# EAGLE design Homebrew Companion Board v2 (EAGLE 9.6.2)
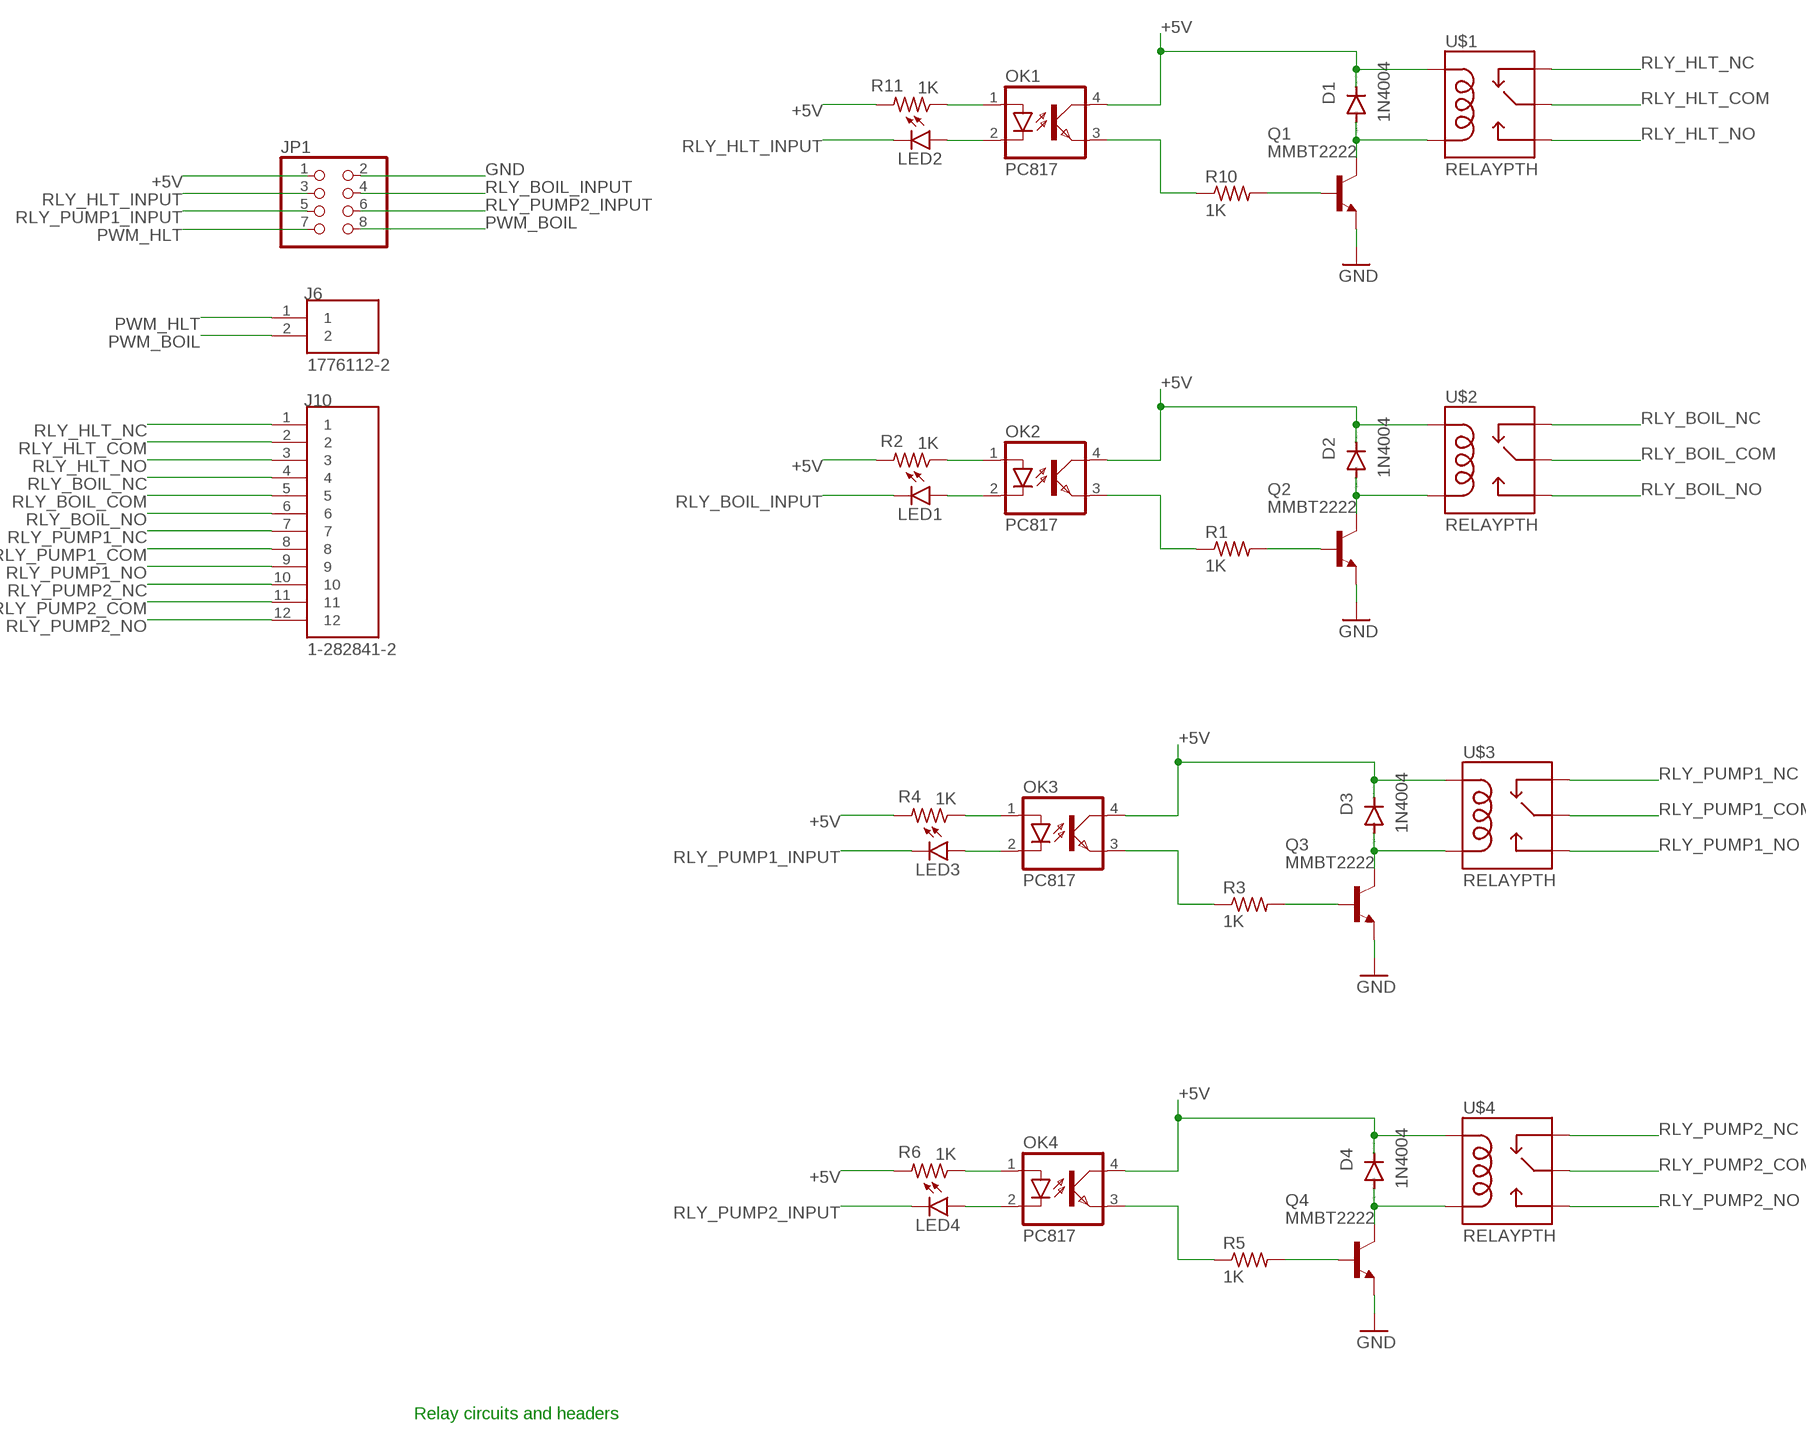
[diagram p0: schematic, sheet 1]

## Parts
D1  1N4004  [DO41-10]
D2  1N4004  [DO41-10]
D3  1N4004  [DO41-10]
D4  1N4004  [DO41-10]
J6  1776112-2  [TE_1776112-2]
J10  1-282841-2  [TE_1-282841-2]
JP1  PINHD-2X4  [2X04]
LED1  LEDCHIP-LED0805  [CHIP-LED0805]
LED2  LEDCHIP-LED0805  [CHIP-LED0805]
LED3  LEDCHIP-LED0805  [CHIP-LED0805]
LED4  LEDCHIP-LED0805  [CHIP-LED0805]
OK1  PC817  [DIL04]
OK2  PC817  [DIL04]
OK3  PC817  [DIL04]
OK4  PC817  [DIL04]
Q1  MMBT2222  [SOT23-BEC]
Q2  MMBT2222  [SOT23-BEC]
Q3  MMBT2222  [SOT23-BEC]
Q4  MMBT2222  [SOT23-BEC]
R1  1K  R-US_R0603  [R0603]
R2  1K  R-US_R0603  [R0603]
R3  1K  R-US_R0603  [R0603]
R4  1K  R-US_R0603  [R0603]
R5  1K  R-US_R0603  [R0603]
R6  1K  R-US_R0603  [R0603]
R10  1K  R-US_R0603  [R0603]
R11  1K  R-US_R0603  [R0603]
U$1  RELAYPTH  [SRD-05VDC-SL-C]
U$2  RELAYPTH  [SRD-05VDC-SL-C]
U$3  RELAYPTH  [SRD-05VDC-SL-C]
U$4  RELAYPTH  [SRD-05VDC-SL-C]

## Nets
+5V: D1.C D2.C D3.C D4.C JP1.1 OK1.4(COL) OK2.4(COL) OK3.4(COL) OK4.4(COL) R2.2 R4.2 R6.2 R11.2 U$1.COIL1 U$2.COIL1 U$3.COIL1 U$4.COIL1
GND: JP1.2 Q1.E Q2.E Q3.E Q4.E
N$1: D2.A Q2.C U$2.COIL0
N$2: D1.A Q1.C U$1.COIL0
N$3: LED2.A OK1.2(C)
N$4: Q1.B R10.2
N$5: OK1.3(EMIT) R10.1
N$6: OK1.1(A) R11.1
N$7: LED1.A OK2.2(C)
N$8: Q2.B R1.2
N$9: OK2.3(EMIT) R1.1
N$10: OK2.1(A) R2.1
N$11: D3.A Q3.C U$3.COIL0
N$12: LED3.A OK3.2(C)
N$13: Q3.B R3.2
N$14: OK3.3(EMIT) R3.1
N$15: OK3.1(A) R4.1
N$16: D4.A Q4.C U$4.COIL0
N$17: LED4.A OK4.2(C)
N$18: Q4.B R5.2
N$19: OK4.3(EMIT) R5.1
N$20: OK4.1(A) R6.1
PWM_BOIL: J6.2 JP1.8
PWM_HLT: J6.1 JP1.7
RLY_BOIL_COM: J10.5 U$2.SWCOMMON
RLY_BOIL_INPUT: JP1.4 LED1.C
RLY_BOIL_NC: J10.4 U$2.SWCLOSED(SWCLOSE)
RLY_BOIL_NO: J10.6 U$2.SWOPEN
RLY_HLT_COM: J10.2 U$1.SWCOMMON
RLY_HLT_INPUT: JP1.3 LED2.C
RLY_HLT_NC: J10.1 U$1.SWCLOSED(SWCLOSE)
RLY_HLT_NO: J10.3 U$1.SWOPEN
RLY_PUMP1_COM: J10.8 U$3.SWCOMMON
RLY_PUMP1_INPUT: JP1.5 LED3.C
RLY_PUMP1_NC: J10.7 U$3.SWCLOSED(SWCLOSE)
RLY_PUMP1_NO: J10.9 U$3.SWOPEN
RLY_PUMP2_COM: J10.11 U$4.SWCOMMON
RLY_PUMP2_INPUT: JP1.6 LED4.C
RLY_PUMP2_NC: J10.10 U$4.SWCLOSED(SWCLOSE)
RLY_PUMP2_NO: J10.12 U$4.SWOPEN

## Notes on the sheet
- Relay circuits and headers

## Library data of the parts
D1-D4 = diode:1N4004: DIODE general purpose rectifier, 1 A; MF: DIODES INC.; MPN: 1N4007-T; OC_NEWARK: 12T2304
J6 = TE-1776112-2:1776112-2: Check availability <https://pricing.snapeda.com/parts/1776112-2/TE%20Connectivity/view-part?ref=eda>; AVAILABILITY: In Stock; COMMENT: 1776112-2; DESCRIPTION: 2P,3.50MM,SIDE ENTRY,HIGH TMP; EU_ROHS_COMPLIANCE: Compliant; MF: AMP - TE CONNECTIVITY; MP: 1776112-2; MPN: 1776112-2; OC_NEWARK: 41AJ4617; PACKAGE: None; PRICE: None; PURCHASE-URL: https://pricing.snapeda.com/search/part/1776112-2/?ref=eda
J10 = TE-1-282841-2:1-282841-2: Check availability <https://pricing.snapeda.com/parts/1-282841-2/TE%20Connectivity/view-part?ref=eda>; AVAILABILITY: In Stock; COMMENT: 1-282841-2; DESCRIPTION: 12 Position Wire to Board Terminal Block Horizontal with Board 0.200 (5.08mm) Through Hole; EU_ROHS_COMPLIANCE: Compliant with Exemptions; MF: AMP - TE CONNECTIVITY; MP: 1-282841-2; MPN: 1-282841-2; OC_NEWARK: 95Y5159; PACKAGE: None; PRICE: None; PURCHASE-URL: https://pricing.snapeda.com/search/part/1-282841-2/?ref=eda
JP1 = pinhead:PINHD-2X4: PIN HEADER; MF: AMP - TE CONNECTIVITY; MPN: 826634-4; OC_NEWARK: 96Y4843
LED1-LED4 = led:LED: LED OSRAM: - CHIPLED LG R971, LG N971, LY N971, LG Q971, LY Q971, LO R971, LY R971 LH N974, LH R974 LS Q976, LO Q976, LY Q976 LO Q996 - Hyper CHIPLED LW Q18S LB Q993, LB Q99A, LB R99A - SideLED LS A670, LO A670, LY A670, LG A670, LP A670 LB A673, LV A673, LT A673, LW A673 LH A674 LY A675 LS A676, LA A676, LO A676, LY A676, LW A676 LS A679, LY A679, LG A679 - Hyper Micro SIDELED® LS Y876, LA Y876, LO Y876, LY Y876 LT Y87S - SmartLED LW L88C, LW L88S LB L89C, LB L89S, LG L890 LS L89K, LO L89K, LY L89K LS L896, LA L896, LO L896, LY L896 - TOPLED LS T670, LO T670, LY T670, LG T670, LP T670 LSG T670, LSP T670, LSY T670, LOP T670, LYG T670 LG T671, LOG T671, LSG T671 LB T673, LV T673, LT T673, LW T673 LH T674 LS T676, LA T676, LO T676, LY T676, LB T676, LH T676, LSB T676, LW T676 LB T67C, LV T67C, LT T67C, LS T67K, LO T67K, LY T67K, LW E67C LS E67B, LA E67B, LO E67B, LY E67B, LB E67C, LV E67C, LT E67C LW T67C LS T679, LY T679, LG T679 LS T770, LO T770, LY T770, LG T770, LP T770 LB T773, LV T773, LT T773, LW T773 LH T774 LS E675, LA E675, LY E675, LS T675 LS T776, LA T776, LO T776, LY T776, LB T776 LHGB T686 LT T68C, LB T68C - Hyper Mini TOPLED® LB M676 - Mini TOPLED Santana® LG M470 LS M47K, LO M47K, LY M47K Source: http://www.osram.convergy.de LUXEON: - LUMILED® LXK2-PW12-R00, LXK2-PW12-S00, LXK2-PW14-U00, LXK2-PW14-V00 LXK2-PM12-R00, LXK2-PM12-S00, LXK2-PM14-U00 LXK2-PE12-Q00, LXK2-PE12-R00, LXK2-PE12-S00, LXK2-PE14-T00, LXK2-PE14-U00 LXK2-PB12-K00, LXK2-PB12-L00, LXK2-PB12-M00, LXK2-PB14-N00, LXK2-PB14-P00, LXK2-PB14-Q00 LXK2-PR12-L00, LXK2-PR12-M00, LXK2-PR14-Q00, LXK2-PR14-R00 LXK2-PD12-Q00, LXK2-PD12-R00, LXK2-PD12-S00 LXK2-PH12-R00, LXK2-PH12-S00 LXK2-PL12-P00, LXK2-PL12-Q00, LXK2-PL12-R00 Source: www.luxeon.com KINGBRIGHT: KA-3528ASYC Source: www.kingbright.com; MF: DIALIGHT; MPN: 5988110107F; OC_NEWARK: 59M5865
OK1-OK4 = optocoupler:PC817: SHARP OPTO COUPLER; MF: BROADCOM; MPN: HCPL-817-000E; OC_FARNELL: 9707727; OC_NEWARK: 36J9610
Q1-Q4 = MMBT2222_:MMBT2222*: NPN Transistor Check availability <https://pricing.snapeda.com/parts/MMBT2222/ON%20Semiconductor/view-part?ref=eda>; AVAILABILITY: In Stock; DESCRIPTION: Bipolar (BJT) Transistor NPN 30 V 600 mA 250MHz 300 mW Surface Mount SOT-23-3 (TO-236); MF: DIODES INC.; MP: MMBT2222; MPN: MMBT2222A-7-F; OC_NEWARK: 51R6809; PACKAGE: SOT-23-3 Fairchild Semiconductor; PRICE: None; PURCHASE-URL: https://pricing.snapeda.com/search/part/MMBT2222/?ref=eda
R1-R6 R10 R11 = rcl:R-US_: RESISTOR, American symbol; MF: YAGEO; MPN: AC0402FR-071KL; OC_NEWARK: 82AH6426; SPICEPREFIX: R
U$1-U$4 = SRD-05VDC-SL-C:RELAY: SPDT relay (COM-00101); OC_NEWARK: unknown

## Board
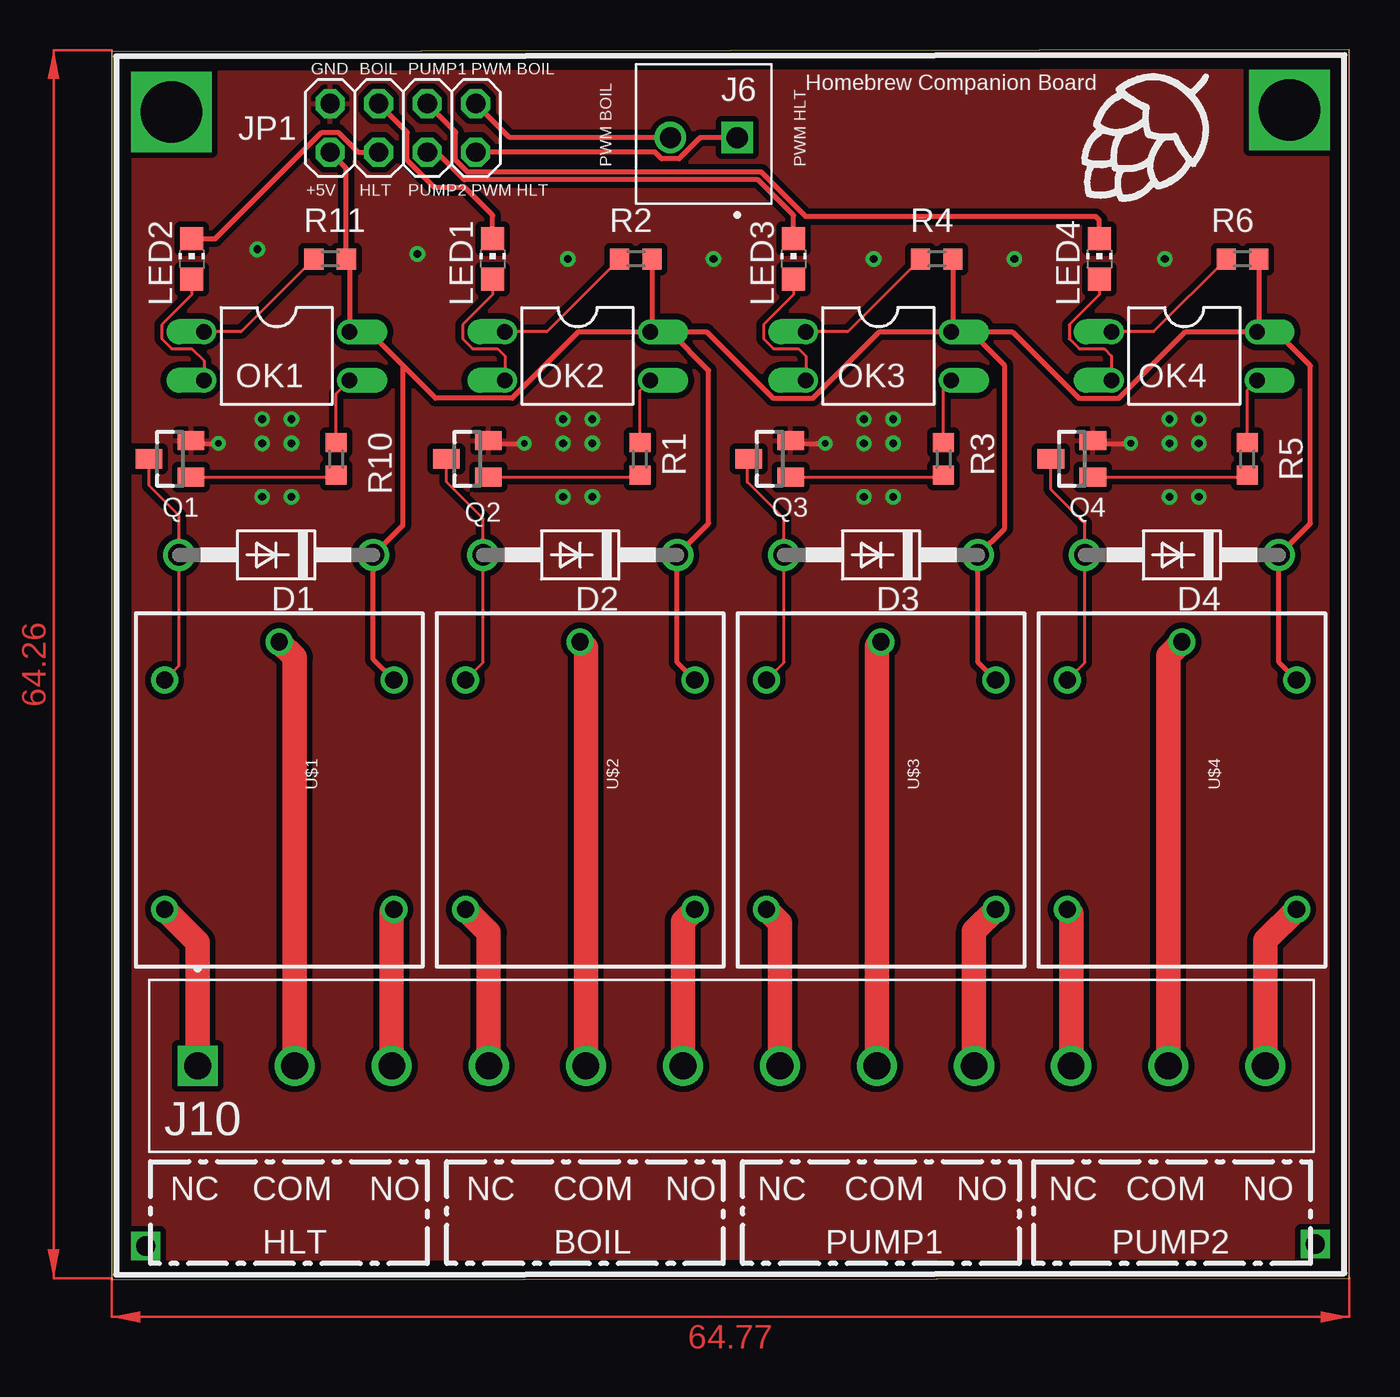
[diagram p1: board, top side]
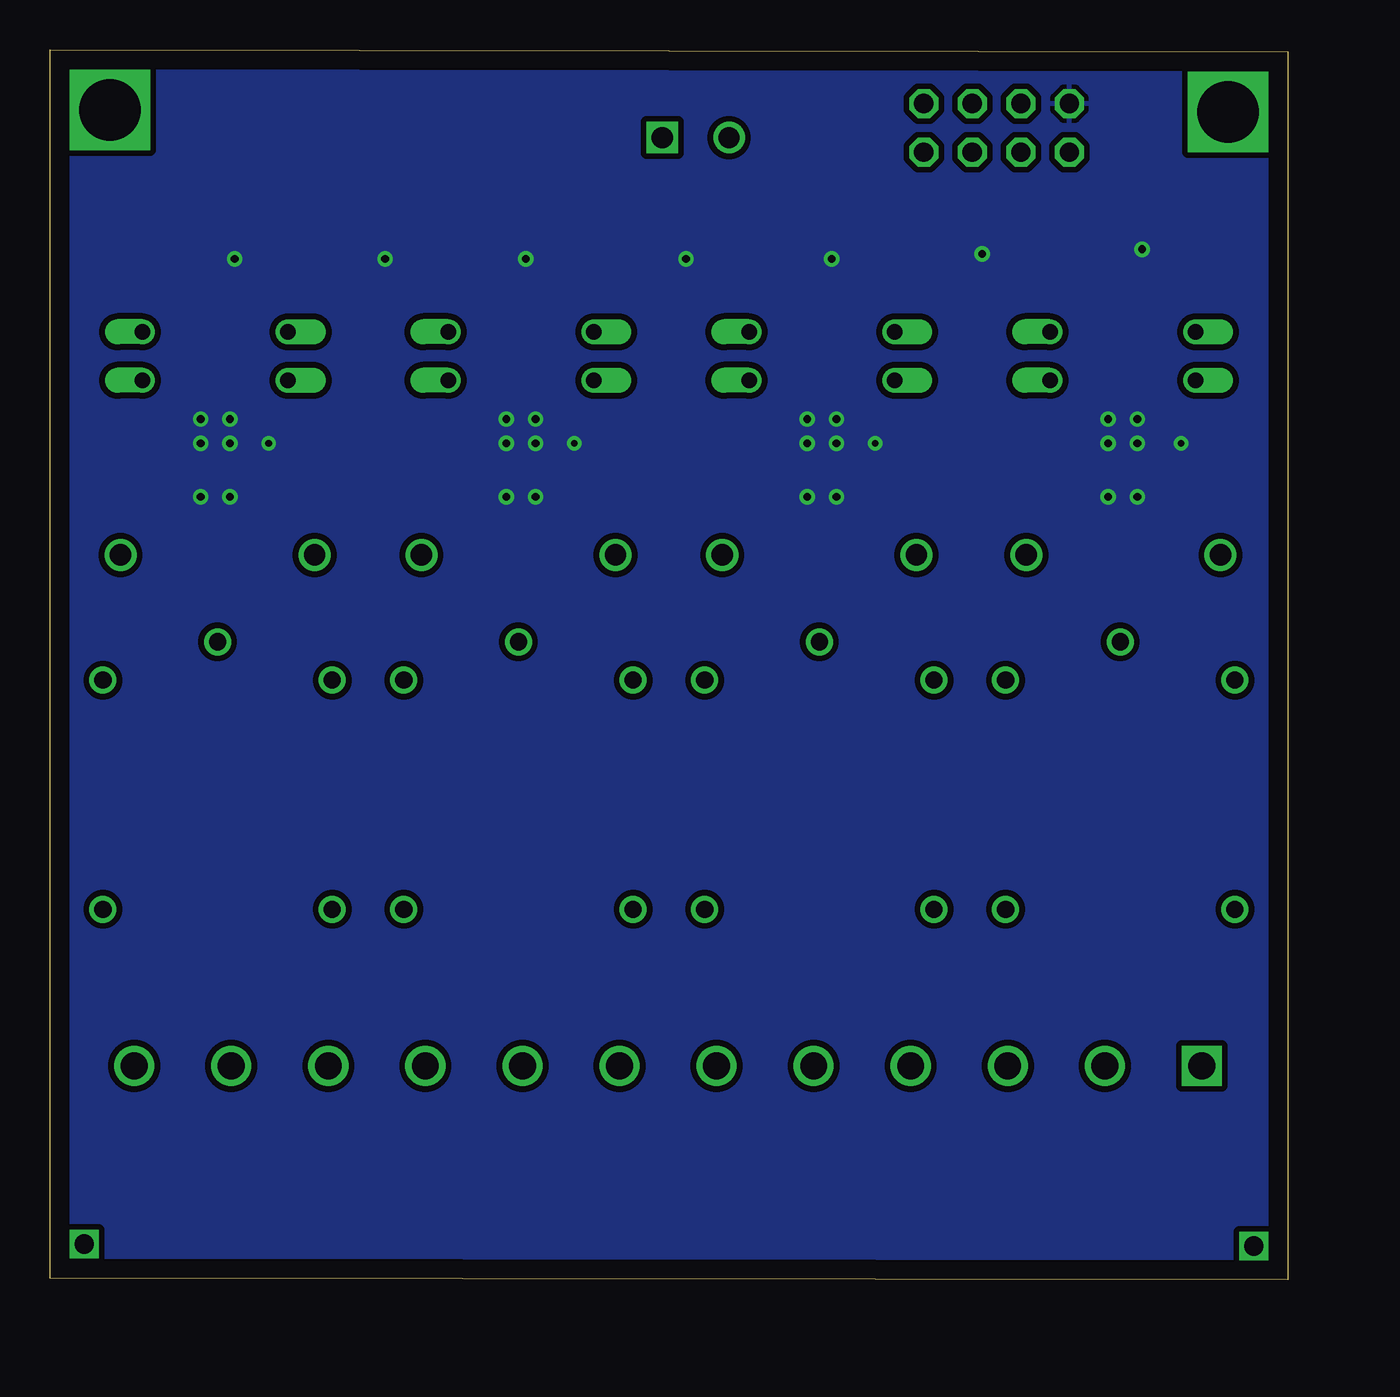
[diagram p2: board, bottom side, seen from below]

Size 64.77 x 64.38 mm. Coordinates in mm from the lower left corner, seen from the top.
Outline: 0,0 64.77,0.1 64.77,64.38 0,64.28 0,0
Copper layers (1*16): Top 0.035mm / dielectric 1.5mm / Bottom 0.035mm
Design rules "default": minimum track width 6mil, minimum drill 0.35mm, track to track 6mil, track to pad 6mil, pad to pad 6mil, via to via 6mil, smd to smd 6mil, copper to edge 40mil, drill to drill 6mil, minimum pad ring 10mil, minimum via ring 8mil, stop-mask expansion 4mil, vias tented up to drill 0mil, thermal gap 10mil

### Footprints (pad centres in the part's own frame; a part is rotated, then mirrored left to right if it is on the bottom)
DO41-10 = drill 1.118: A 5.08,0; C -5.08,0
TE_1776112-2 = drill 1.1 square: 1 -1.75,0 | drill 1.1: 2 1.75,0
TE_1-282841-2 = drill 1.4 square: 1 -27.94,0 | drill 1.4: 2 -22.86,0; 3 -17.78,0; 4 -12.7,0; 5 -7.62,0; 6 -2.54,0; 7 2.54,0; 8 7.62,0; 9 12.7,0; 10 17.78,0; 11 22.86,0; 12 27.94,0
2X04 = drill 1.016 octagon: 1 -3.81,-1.27; 2 -3.81,1.27; 3 -1.27,-1.27; 4 -1.27,1.27; 5 1.27,-1.27; 6 1.27,1.27; 7 3.81,-1.27; 8 3.81,1.27
CHIP-LED0805 = smd 1.2 x 1.2: A 0,-1.05; C 0,1.05
DIL04 = drill 0.813 offset: 1 -1.27,-3.81; 2 1.27,-3.81; 3 1.27,3.81; 4 -1.27,3.81
SOT23-BEC = smd 1 x 1.4: B -0.95,-1.1; C 0,1.1; E 0.95,-1.1
R0603 = smd 1 x 1.1: 1 -0.85,0; 2 0.85,0
SRD-05VDC-SL-C = drill 0.9: COIL0 -5.39,-6.12; COIL1 -5.39,5.88; SWCLOSED 6.61,-6.12; SWCOMMON -7.39,-0.12; SWOPEN 6.61,5.88

### Placement (x,y rotation side)
D1  8.6,37.95 180 top
D2  24.52,37.95 180 top
D3  40.27,37.95 180 top
D4  56.01,37.95 180 top
J6  30.99,59.79 180 top
J10  32.44,11.2 0 top
JP1  15.24,60.3 0 top
LED1  19.94,53.44 0 top
LED2  4.19,53.44 0 top
LED3  35.69,53.44 0 top
LED4  51.69,53.44 0 top
OK1  8.64,48.36 270 top
OK2  24.38,48.36 270 top
OK3  40.13,48.36 270 top
OK4  56.13,48.36 270 top
Q1  3.05,42.98 90 top
Q2  18.61,42.98 90 top
Q3  34.44,42.98 90 top
Q4  50.26,42.98 90 top
R1  27.64,42.98 270 top
R2  27.43,53.44 0 top
R3  43.53,42.98 270 top
R4  43.18,53.44 0 top
R5  59.43,42.98 270 top
R6  59.18,53.44 0 top
R10  11.75,42.98 270 top
R11  11.43,53.44 0 top
U$1  8.89,26.01 270 top
U$2  24.64,26.01 270 top
U$3  40.39,26.01 270 top
U$4  56.13,26.01 270 top

### Tracks (layer width: path | path; a pad name or v marks a point on that pad's centre or on a via)
+5V
  Top 0.254: U$1.COIL1 13.68,32.48 D1.C 15.24,39.5 15.24,47.85 | U$2.COIL1 29.6,32.32 D2.C 31.24,39.59 31.24,47.6 29.21,49.63 OK2.4 | U$3.COIL1 45.35,32.32 D3.C 46.74,39.34 46.74,47.85 44.96,49.63 | U$4.COIL1 61.09,32.32 D4.C 62.74,39.59 62.74,47.85 60.96,49.63 OK4.4 | R2.2 28.28,49.72 OK2.4 | R4.2 44.03,49.72 OK3.4 | R6.2 60.03,49.72 OK4.4 | JP1.1 12.28,58.18 R11.2 12.45,53.28 OK1.4 13.46,49.63 15.24,47.85 | OK2.4 24.44,49.63 20.96,46.15 16.94,46.15 15.24,47.85 | OK2.4 31.13,49.63 34.61,46.15 36.71,46.15 40.19,49.63 OK3.4 | 44.96,49.63 47.13,49.63 50.61,46.15 52.71,46.15 56.19,49.63 OK4.4 | 44.96,49.63 OK3.4
GND  (via drill 0.35, 0.4)
  Top 0.254: Q1.E 4.29,43.79 v5.59,43.79 | Q2.E 19.85,43.79 v21.59,43.79 | Q3.E 35.67,43.79 v37.34,43.79 | Q4.E 51.49,43.79 v53.34,43.79
  other vias: 7.62,53.95 16,53.7 23.88,53.44 31.5,53.44 39.88,53.44 47.24,53.44 55.12,53.44 7.87,45.06 9.4,45.06 9.4,43.79 7.87,43.79 7.87,41 9.4,41 23.62,45.06 25.15,45.06 25.15,43.79 23.62,43.79 23.62,41 25.15,41 39.37,45.06 40.89,45.06 40.89,43.79 39.37,43.79 39.37,41 40.89,41 55.37,45.06 56.9,45.06 56.9,43.79 55.37,43.79 55.37,41 56.9,41
  pour Top (isolate 0.305): 0,64.36 64.77,64.36 64.77,0.1 0,0.1
  pour Bottom (isolate 0.305): 0,64.36 64.77,64.36 64.77,0.1 0,0.1
N$1
  Top 0.152: U$2.COIL0 19.44,32.32 D2.A 19.44,39.85 17.51,41.77 Q2.C
N$2
  Top 0.152: U$1.COIL0 3.52,32.15 D1.A 3.52,40.01 1.95,41.59 Q1.C
N$3
  Top 0.152: LED2.A 4.19,51.57 2.62,50 2.62,49.26 3.14,48.74 4.19,48.74 4.83,48.11 OK1.2
N$4
  Top 0.152: Q1.B 11.65,42.03 R10.2
N$5
  Top 0.152: R10.1 11.75,46.39 OK1.3
N$6
  Top 0.152: R11.1 6.77,49.63 OK1.1
N$7
  Top 0.152: LED1.A 19.94,51.57 18.36,50 18.36,49.26 18.89,48.74 20.19,48.74 20.57,48.36 OK2.2
N$8
  Top 0.152: Q2.B 27.54,42.03 R1.2
N$9
  Top 0.152: R1.1 27.64,46.54 OK2.3
N$10
  Top 0.152: R2.1 22.77,49.63 OK2.1
N$11
  Top 0.152: U$3.COIL0 35.19,32.32 D3.A 35.19,39.85 33.27,41.76 33.27,42.92 Q3.C
N$12
  Top 0.152: LED3.A 35.69,51.57 34.11,50 34.11,49.26 34.63,48.74 35.94,48.74 36.32,48.36 OK3.2
N$13
  Top 0.152: Q3.B 43.43,42.03 R3.2
N$14
  Top 0.152: R3.1 43.53,46.68 OK3.3
N$15
  Top 0.152: R4.1 38.52,49.63 OK3.1
N$16
  Top 0.152: U$4.COIL0 50.93,32.32 D4.A 50.93,39.59 49.16,41.37 Q4.C
N$17
  Top 0.152: LED4.A 51.69,51.57 50.11,50 50.11,49.26 50.64,48.74 51.94,48.74 52.32,48.36 OK4.2
N$18
  Top 0.152: Q4.B 59.33,42.03 R5.2
N$19
  Top 0.152: R5.1 59.43,46.57 OK4.3
N$20
  Top 0.152: R6.1 54.52,49.63 OK4.1
N$52  (via drill 3.2)
  other vias: 3.12,61.14
N$53  (via drill 3.2)
  other vias: 61.65,61.24
N$54  (via drill 1)
  other vias: 1.78,1.78
N$55  (via drill 1)
  other vias: 62.99,1.88
PWM_BOIL
  Top 0.254: J6.2 20.83,59.79 JP1.8
PWM_HLT
  Top 0.254: J6.1 30.8,59.79 29.69,58.69 28.78,58.69 28.44,59.03 JP1.7
RLY_BOIL_COM
  Top 1.27: J10.5 24.82,33.1 U$2.SWCOMMON
RLY_BOIL_INPUT
  Top 0.254: LED1.C 19.94,55.73 18.49,57.18 16.89,57.18 15.47,58.6 15.47,60.07 JP1.4
RLY_BOIL_NC
  Top 1.27: J10.4 19.74,18.18 U$2.SWCLOSED
RLY_BOIL_NO
  Top 1.27: J10.6 29.9,18.78 U$2.SWOPEN
RLY_HLT_COM
  Top 1.27: J10.2 9.58,32.59 U$1.SWCOMMON
RLY_HLT_INPUT
  Top 0.254: LED2.C 5.42,54.49 11,60.07 11.86,60.07 12.9,59.03 JP1.3
RLY_HLT_NC
  Top 1.27: J10.1 4.5,17.67 U$1.SWCLOSED
RLY_HLT_NO
  Top 1.27: J10.3 14.66,19.29 U$1.SWOPEN
RLY_PUMP1_COM
  Top 1.27: J10.8 40.06,33.19 U$3.SWCOMMON
RLY_PUMP1_INPUT
  Top 0.254: LED3.C 35.69,55.73 33.83,57.58 18.45,57.58 17,59.03 JP1.5
RLY_PUMP1_NC
  Top 1.27: J10.7 34.98,18.69 U$3.SWCLOSED
RLY_PUMP1_NO
  Top 1.27: J10.9 45.14,18.27 U$3.SWOPEN
RLY_PUMP2_COM
  Top 1.27: J10.11 55.3,32.68 U$4.SWCOMMON
RLY_PUMP2_INPUT
  Top 0.254: LED4.C 51.69,55.47 51.5,55.66 36.33,55.66 34,57.99 18.62,57.99 18.01,58.6 18.01,60.07 JP1.6
RLY_PUMP2_NC
  Top 1.27: J10.10 50.22,19.2 U$4.SWCLOSED
RLY_PUMP2_NO
  Top 1.27: J10.12 60.38,17.76 U$4.SWOPEN
(copper drawn outside any net)
  shapes: Top area x2

### Text on the board
tPlace: Homebrew Companion Board
tNames: GND | BOIL | PUMP1 | PWM BOIL | PWM BOIL | PWM HLT | +5V | HLT | PUMP2 | PWM HLT | NC | COM | NO | NC | COM | NO | NC | COM | NO | NC | COM | NO | HLT | BOIL | PUMP1 | PUMP2